# EAGLE design W640D (EAGLE 6.6.0)
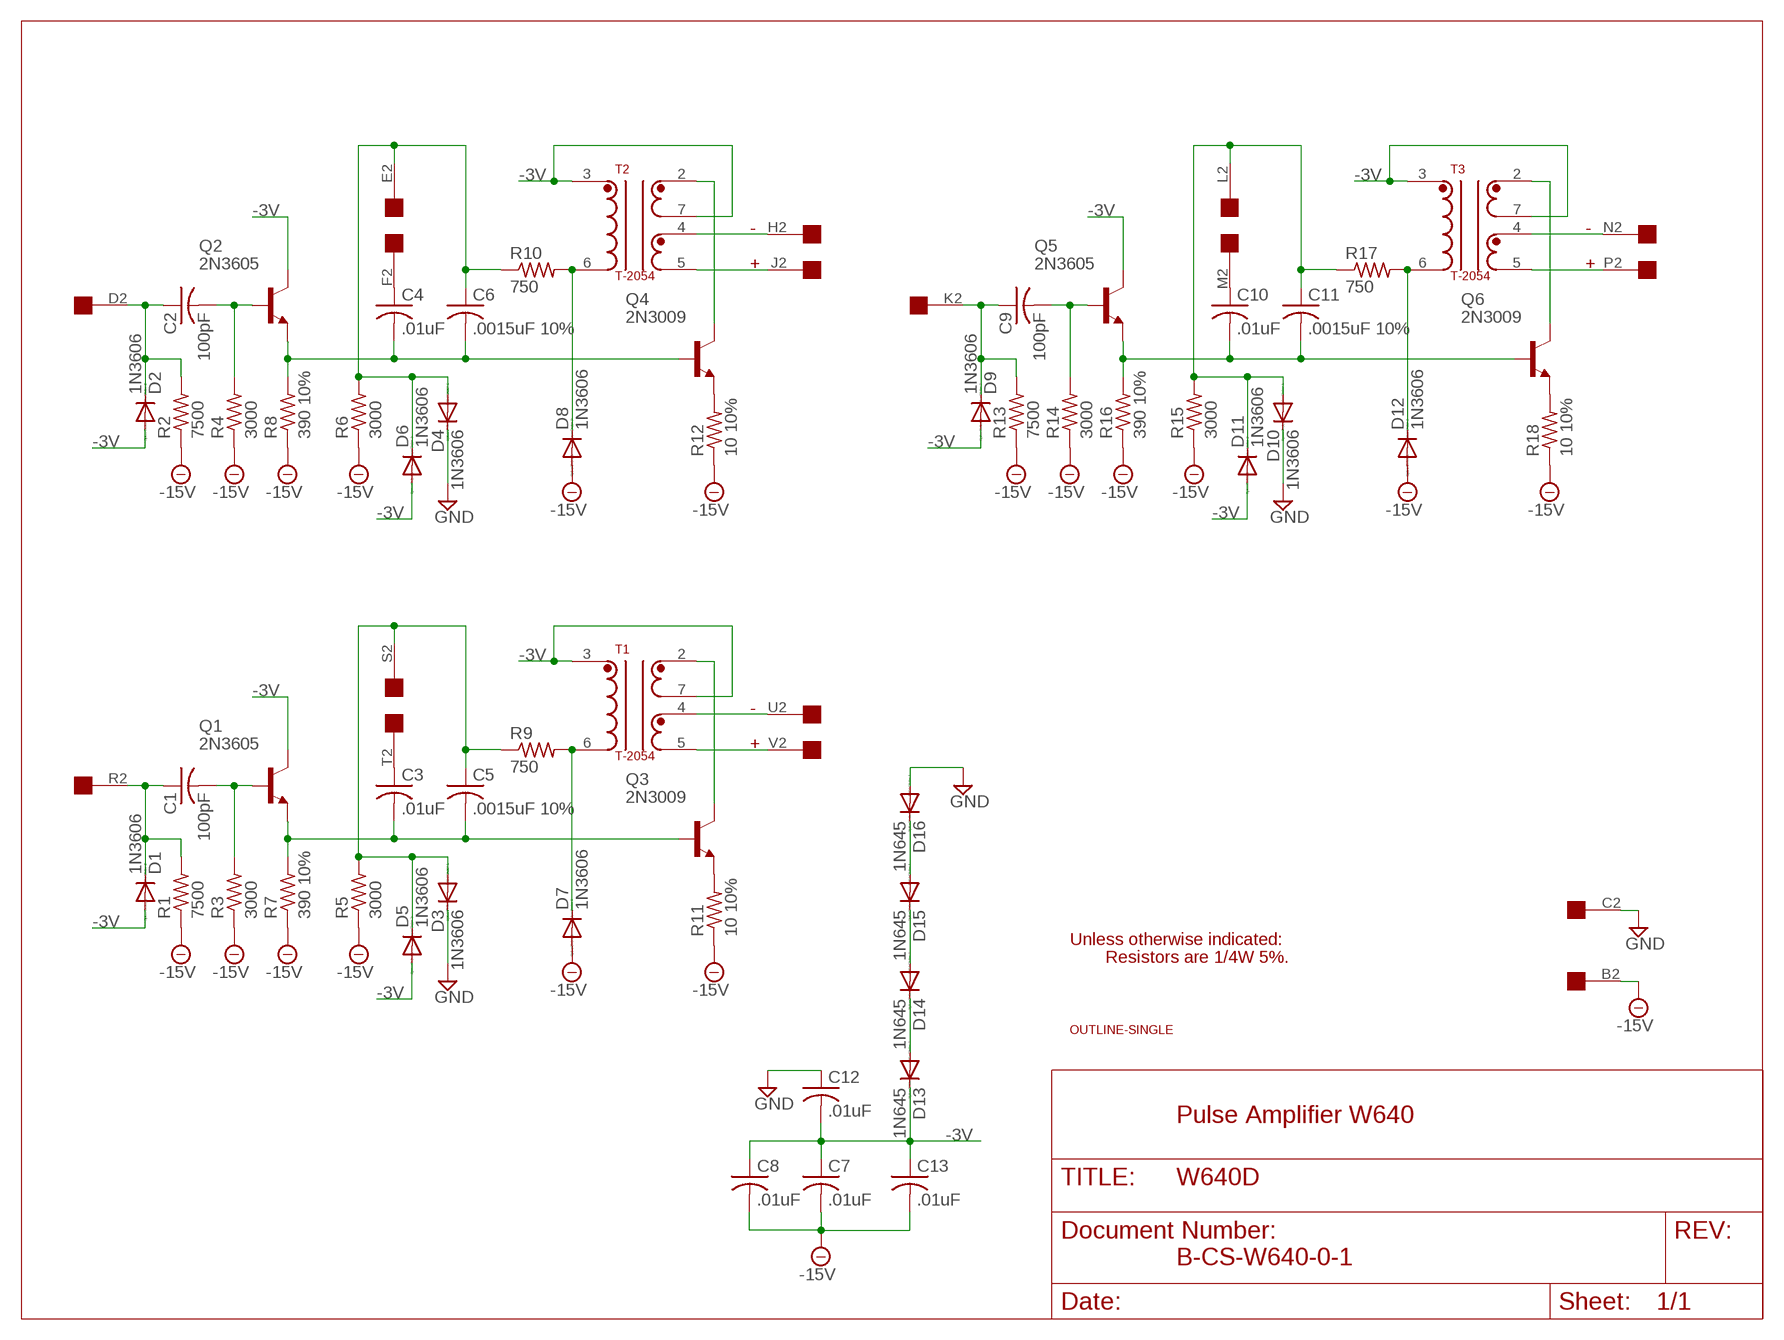
[diagram p0: schematic, sheet 1]

## Parts
C1  100pF  C-US050-025X075  [C050-025X075]
C2  100pF  C-US050-025X075  [C050-025X075]
C3  .01uF  C-US050-025X075  [C050-025X075]
C4  .01uF  C-US050-025X075  [C050-025X075]
C5  .0015uF 10%  C-US050-025X075  [C050-025X075]
C6  .0015uF 10%  C-US050-025X075  [C050-025X075]
C7  .01uF  C-US050-025X075  [C050-025X075]
C8  .01uF  C-US050-025X075  [C050-025X075]
C9  100pF  C-US050-025X075  [C050-025X075]
C10  .01uF  C-US050-025X075  [C050-025X075]
C11  .0015uF 10%  C-US050-025X075  [C050-025X075]
C12  .01uF  C-US050-025X075  [C050-025X075]
C13  .01uF  C-US050-025X075  [C050-025X075]
D1  1N3606  1N4148DO35-10  [DO35-10]
D2  1N3606  1N4148DO35-10  [DO35-10]
D3  1N3606  1N4148DO35-10  [DO35-10]
D4  1N3606  1N4148DO35-10  [DO35-10]
D5  1N3606  1N4148DO35-10  [DO35-10]
D6  1N3606  1N4148DO35-10  [DO35-10]
D7  1N3606  1N4148DO35-10  [DO35-10]
D8  1N3606  1N4148DO35-10  [DO35-10]
D9  1N3606  1N4148DO35-10  [DO35-10]
D10  1N3606  1N4148DO35-10  [DO35-10]
D11  1N3606  1N4148DO35-10  [DO35-10]
D12  1N3606  1N4148DO35-10  [DO35-10]
D13  1N645  1N4148DO35-10  [DO35-10]
D14  1N645  1N4148DO35-10  [DO35-10]
D15  1N645  1N4148DO35-10  [DO35-10]
D16  1N645  1N4148DO35-10  [DO35-10]
Q1  2N3605  2N2219  [TO5]
Q2  2N3605  2N2219  [TO5]
Q3  2N3009  2N2219  [TO5]
Q4  2N3009  2N2219  [TO5]
Q5  2N3605  2N2219  [TO5]
Q6  2N3009  2N2219  [TO5]
R1  7500  R-US_0207/10  [0207/10]
R2  7500  R-US_0207/10  [0207/10]
R3  3000  R-US_0207/10  [0207/10]
R4  3000  R-US_0207/10  [0207/10]
R5  3000  R-US_0207/10  [0207/10]
R6  3000  R-US_0207/10  [0207/10]
R7  390 10%  R-US_0207/10  [0207/10]
R8  390 10%  R-US_0207/10  [0207/10]
R9  750  R-US_0207/10  [0207/10]
R10  750  R-US_0207/10  [0207/10]
R11  10 10%  R-US_0207/10  [0207/10]
R12  10 10%  R-US_0207/10  [0207/10]
R13  7500  R-US_0207/10  [0207/10]
R14  3000  R-US_0207/10  [0207/10]
R15  3000  R-US_0207/10  [0207/10]
R16  390 10%  R-US_0207/10  [0207/10]
R17  750  R-US_0207/10  [0207/10]
R18  10 10%  R-US_0207/10  [0207/10]
T1  T-2054  [TRANSFORMER6B]
T2  T-2054  [TRANSFORMER6B]
T3  T-2054  [TRANSFORMER6B]
U$1  OUTLINE-SINGLE  [SINGLE]
U$2  EDGE-1  [EDGE-CON1]

## Nets
-3V: C7.1 C8.1 C12.2 C13.1 D1.A D2.A D5.A D6.A D9.A D11.A D13.C Q1.3(C) Q2.3(C) Q5.3(C) T1.3 T1.7 T2.3 T2.7 T3.3 T3.7
-15V: C7.2 C8.2 C13.2 D7.A D8.A D12.A R1.1 R2.1 R3.1 R4.1 R5.1 R6.1 R7.1 R8.1 R11.1 R12.1 R13.1 R14.1 R15.1 R16.1 R18.1 U$2.B2
GND [Supply]: C12.1 D3.C D4.C D10.C D16.A U$2.C2
N$1: D8.C R10.2 T2.6
N$2: C2.1 D2.C R2.2 U$2.D2
N$3: C2.2 Q2.2(B) R4.2
N$4: C4.2 C6.2 Q2.1(E) Q4.2(B) R8.2
N$5: C4.1 U$2.F2
N$6: C6.1 D4.A D6.C R6.2 R10.1 U$2.E2
N$7: Q4.3(C) T2.2
N$8: Q4.1(E) R12.2
N$9: T1.4 U$2.U2
N$10: T2.4 U$2.H2
N$11: T1.5 U$2.V2
N$12: T2.5 U$2.J2
N$13: D7.C R9.2 T1.6
N$14: C1.1 D1.C R1.2 U$2.R2
N$15: C1.2 Q1.2(B) R3.2
N$16: C3.2 C5.2 Q1.1(E) Q3.2(B) R7.2
N$17: C3.1 U$2.T2
N$18: C5.1 D3.A D5.C R5.2 R9.1 U$2.S2
N$19: Q3.3(C) T1.2
N$20: Q3.1(E) R11.2
N$21: T3.4 U$2.N2
N$22: T3.5 U$2.P2
N$23: D12.C R17.2 T3.6
N$24: C9.1 D9.C R13.2 U$2.K2
N$25: C9.2 Q5.2(B) R14.2
N$26: C10.2 C11.2 Q5.1(E) Q6.2(B) R16.2
N$27: C10.1 U$2.M2
N$28: C11.1 D10.A D11.C R15.2 R17.1 U$2.L2
N$29: Q6.3(C) T3.2
N$30: Q6.1(E) R18.2
N$31: D15.A D16.C
N$32: D13.A D14.C
N$33: D14.A D15.C
Unconnected: U$2.A2

## Notes on the sheet
- - | -
- + | +
- -
- +
- Unless otherwise indicated:
- Resistors are 1/4W 5%.
- Pulse Amplifier W640
- B-CS-W640-0-1

## Library data of the parts
C1-C13 = rcl:C-US: CAPACITOR, American symbol
D1-D16 = diode:1N4148: DIODE high speed (Philips)
Q1-Q6 = transistor-npn:2N2219: NPN Transistor
R1-R18 = rcl:R-US_: RESISTOR, American symbol
T1-T3 = dec-con:T-2054: T-2054 Pulse Transformer
U$1 = dec-con:OUTLINE-*: Board outlines for DEC boards.
U$2 = dec-con:EDGE-1: Single-Sided DEC Edge Connector -- (side 2)

## Net classes
1 Supply: width 0.813 mm

## Board
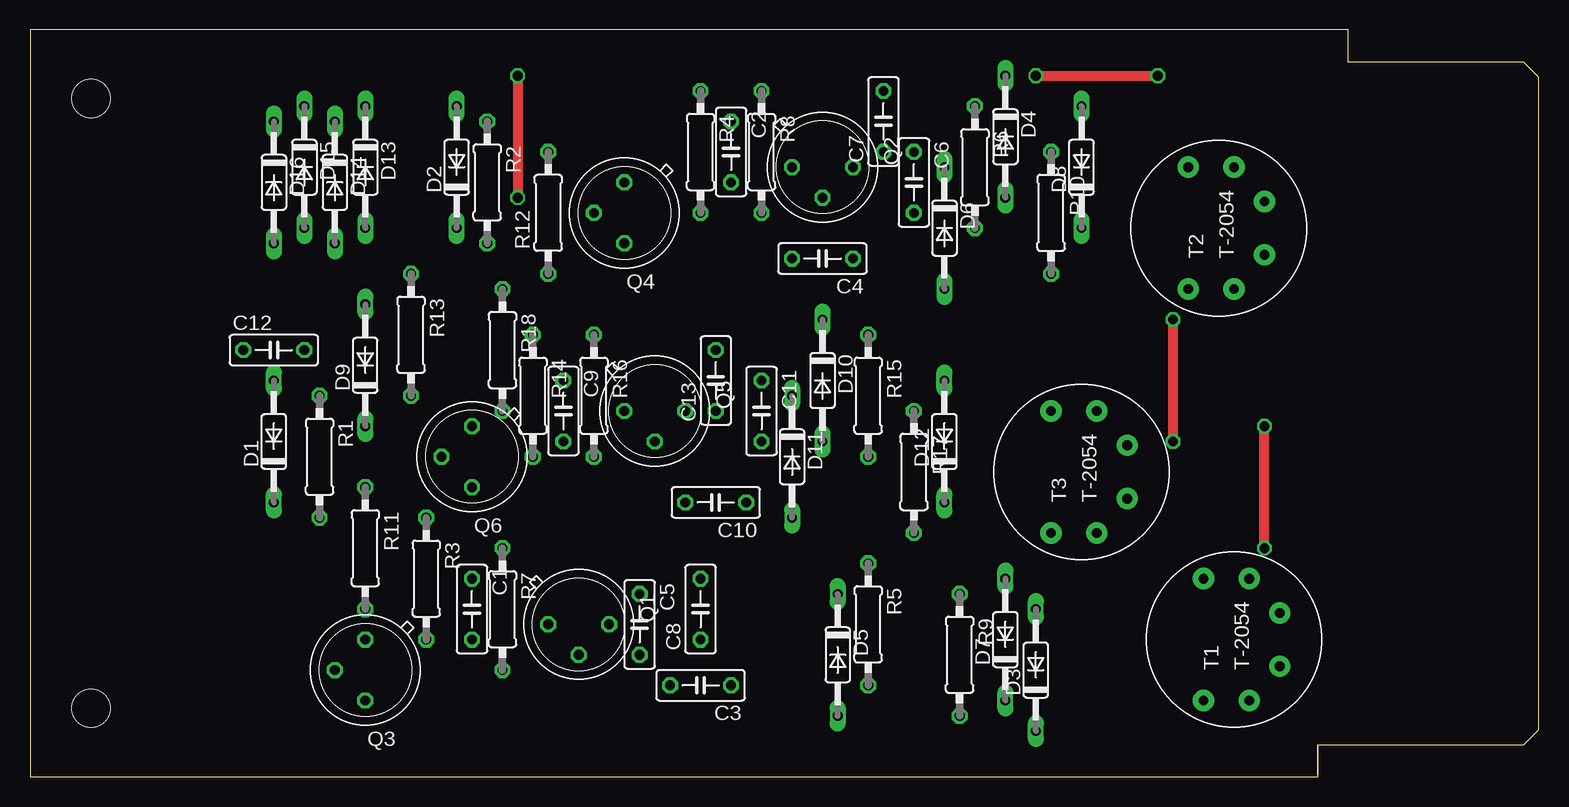
[diagram p1: board, top side]
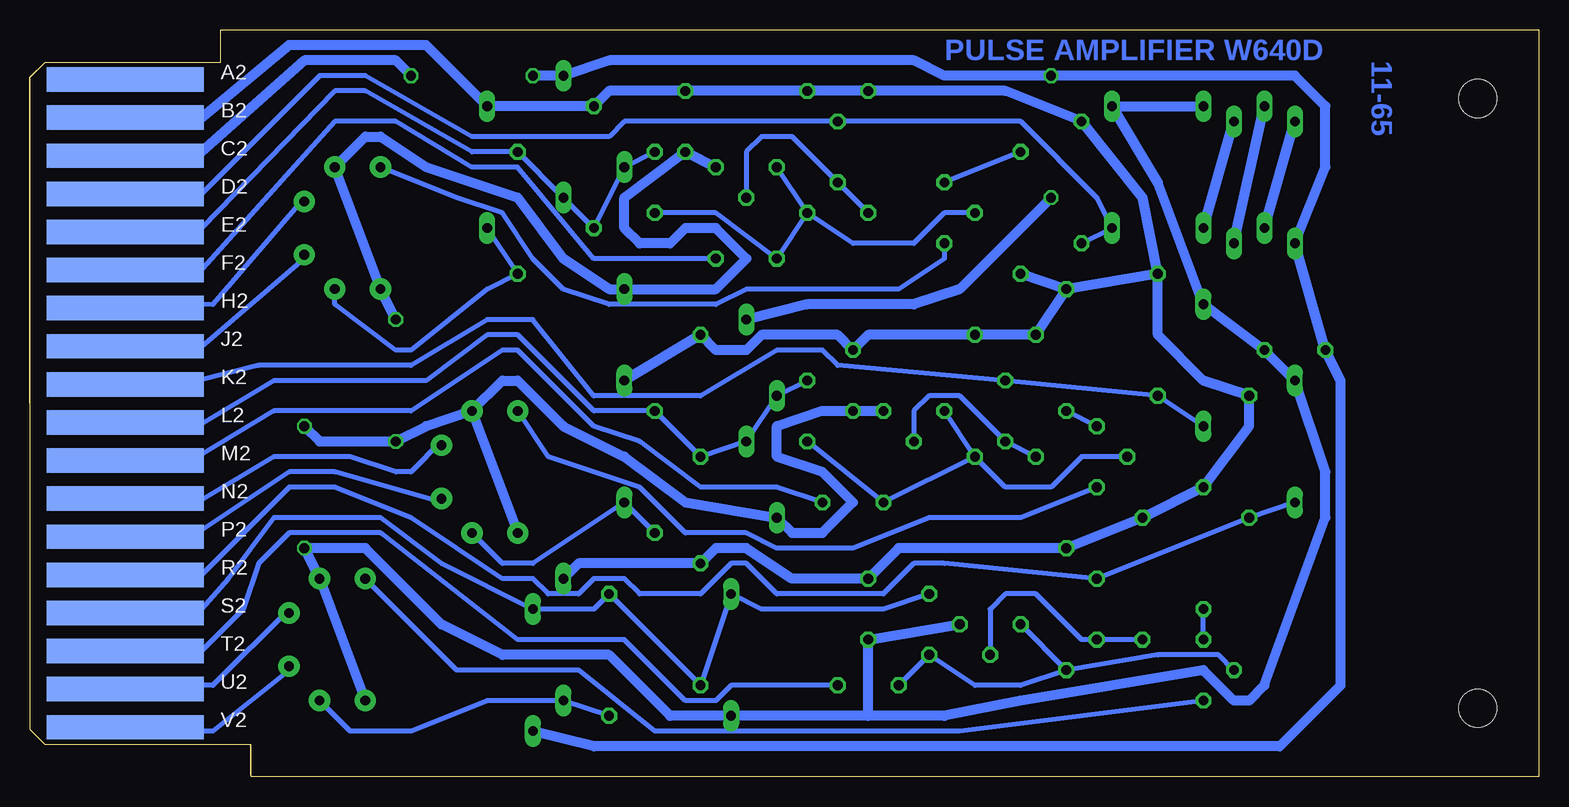
[diagram p2: board, bottom side, seen from below]

Size 125.73 x 62.23 mm. Coordinates in mm from the lower left corner, seen from the top.
Copper layers (1+16): Top 0.035mm / dielectric 1.5mm / Bottom 0.035mm
Design rules "16mils": minimum track width 16mil, minimum drill 32mil, track to track 15mil, track to pad 10mil, pad to pad 10mil, via to via 10mil, smd to smd 10mil, copper to edge 13mil, drill to drill 10mil, minimum pad ring 10mil, minimum via ring 8mil, stop-mask expansion 0mil, vias tented up to drill 0mil, thermal gap 10mil

### Footprints (pad centres in the part's own frame; a part is rotated, then mirrored left to right if it is on the bottom)
C050-025X075 = drill 0.813 octagon: 1 -2.54,0; 2 2.54,0
DO35-10 = drill 0.813 long: A 5.08,0; C -5.08,0
TO5 = drill 0.813 octagon: 1 0,-2.54; 2 2.54,0; 3 0,2.54
0207/10 = drill 0.813 octagon: 1 -5.08,0; 2 5.08,0
TRANSFORMER6B = drill 0.813 pad 1.778: 2 5.08,2.54; 3 5.08,-1.27; 4 2.223,-3.81; 5 -2.223,-3.81; 6 -5.08,-1.27; 7 -5.08,2.54
SINGLE = hole 3.175: 120.65,56.515; 120.65,5.715
EDGE-CON1 = smd 13.106 x 2.032 bottom: A2 7.938,4.128; B2 7.938,7.303; C2 7.938,10.477; D2 7.938,13.652; E2 7.938,16.828; F2 7.938,20.003; H2 7.938,23.177; J2 7.938,26.352; K2 7.938,29.527; L2 7.938,32.703; M2 7.938,35.877; N2 7.938,39.053; P2 7.938,42.227; R2 7.938,45.403; S2 7.938,48.578; T2 7.938,51.752; U2 7.938,54.928; V2 7.938,58.102

### Placement (x,y rotation side)
C1  36.83,13.97 270 top
C2  58.42,52.07 270 top
C3  55.88,7.62 180 top
C4  66.04,43.18 180 top
C5  50.8,12.7 270 top
C6  73.66,49.53 270 top
C7  71.12,54.61 90 top
C8  55.88,13.97 90 top
C9  44.45,30.48 270 top
C10  57.15,22.86 180 top
C11  60.96,30.48 270 top
C12  20.32,35.56 0 top
C13  57.15,33.02 90 top
D1  20.32,27.94 90 top
D2  35.56,50.8 90 top
D3  83.82,8.89 90 top
D4  81.28,53.34 270 top
D5  67.31,10.16 270 top
D6  76.2,45.72 270 top
D7  81.28,11.43 90 top
D8  87.63,50.8 90 top
D9  27.94,34.29 90 top
D10  66.04,33.02 270 top
D11  63.5,26.67 270 top
D12  76.2,27.94 90 top
D13  27.94,50.8 270 top
D14  25.4,49.53 270 top
D15  22.86,50.8 270 top
D16  20.32,49.53 270 top
Q1  45.72,12.7 270 top
Q2  66.04,50.8 270 top
Q3  27.94,8.89 180 top
Q4  49.53,46.99 180 top
Q5  52.07,30.48 270 top
Q6  36.83,26.67 180 top
R1  24.13,26.67 270 top
R2  38.1,49.53 270 top
R3  33.02,16.51 270 top
R4  55.88,52.07 270 top
R5  69.85,12.7 270 top
R6  78.74,50.8 270 top
R7  39.37,13.97 270 top
R8  60.96,52.07 270 top
R9  77.47,10.16 270 top
R10  85.09,46.99 270 top
R11  27.94,19.05 270 top
R12  43.18,46.99 90 top
R13  31.75,36.83 270 top
R14  41.91,31.75 270 top
R15  69.85,31.75 270 top
R16  46.99,31.75 270 top
R17  73.66,25.4 270 top
R18  39.37,35.56 270 top
T1  100.33,11.43 90 top
T2  99.06,45.72 90 top
T3  87.63,25.4 90 top
U$1  125.73,62.23 180 top
U$2  125.73,62.23 180 top

### Tracks (layer width: path | path; a pad name or v marks a point on that pad's centre or on a via)
-3V  (via drill 0.81)
  Top 0.813: v95.25,27.94 v95.25,38.1 | v102.87,19.05 v102.87,29.21
  Bottom 0.813: T3.3 T3.7 | T3.3 92.71,29.21 v95.25,27.94 101.6,27.94 v102.87,29.21 | v95.25,38.1 T2.7 T2.3 97.79,53.34 96.52,53.34 92.71,50.8 85.09,48.26 81.28,43.18 77.47,40.64 D6.A 68.58,40.64 66.04,43.18 68.58,45.72 71.12,45.72 72.39,44.45 74.93,44.45 76.2,45.72 76.2,48.26 C7.1 Q2.3 | T1.7 T1.3 v102.87,19.05 97.79,19.05 91.44,12.7 86.36,10.16 77.47,10.16 72.39,5.08 D5.A 55.88,5.08 | D13.C D2.A 31.75,49.53 D9.A C12.2 D1.A 17.78,25.4 17.78,21.59 22.86,7.62 24.13,6.35 25.4,6.35 27.94,8.89 43.18,6.35 49.53,5.08 55.88,5.08 | T3.3 86.36,33.02 85.09,33.02 81.28,29.21 76.2,26.67 71.12,22.86 D11.A 62.23,20.32 59.69,20.32 57.15,22.86 59.69,25.4 63.5,26.67 63.5,29.21 59.69,30.48 C13.1 Q5.3 | Q1.3 C8.1 55.88,5.08
-15V
  Bottom 0.813: U$2.B2 116.84,54.61 111.76,54.61 104.14,60.96 92.71,60.96 D8.A R6.1 77.47,57.15 C7.2 R8.1 R4.1 44.45,57.15 R2.1 33.02,48.26 R13.1 | R13.1 R18.1 | R18.1 R12.1 | R18.1 R14.1 R16.1 55.88,36.83 C13.2 58.42,36.83 64.77,36.83 66.04,35.56 68.58,35.56 R15.1 D12.A | R13.1 31.75,36.83 27.94,33.02 R1.1 24.13,29.21 R11.1 R3.1 R7.1 53.34,19.05 C8.2 62.23,16.51 66.04,19.05 68.58,19.05 R5.1 80.01,17.78 D7.A
GND  (via drill 0.81)
  Top 0.813: v83.82,58.42 v93.98,58.42 | v40.64,58.42 v40.64,48.26
  Bottom 0.813: U$2.C2 116.84,52.07 111.44,52.07 102.87,59.69 95.25,59.69 v93.98,58.42 | v83.82,58.42 D4.C 77.47,59.69 52.07,59.69 49.53,58.42 v40.64,58.42 20.32,58.42 17.78,55.88 17.78,50.8 D16.A C12.1 16.51,33.02 16.51,7.62 21.59,2.54 78.74,2.54 D3.C | v40.64,48.26 48.26,40.64 52.07,39.37 60.96,39.37 D10.C
N$1
  Bottom 0.406: D8.C R10.2 87.63,40.64 93.98,35.56 95.25,35.56 100.33,39.37 T2.6
N$2
  Bottom 0.406: U$2.D2 116.84,48.26 111.76,48.26 101.6,58.42 97.79,58.42 88.9,53.34 77.47,53.34 76.2,54.61 C2.1 43.18,54.61 36.83,48.26 D2.C R2.2
N$3
  Bottom 0.406: R4.2 C2.2 62.23,53.34 64.77,53.34 66.04,52.07 Q2.2
N$4
  Bottom 0.406: Q4.2 49.53,46.99 52.07,44.45 57.15,44.45 R8.2 | R8.2 Q2.1 | C6.2 68.58,46.99 C4.2 R8.2
N$5
  Bottom 0.406: U$2.F2 116.84,41.91 111.76,41.91 100.33,54.61 95.25,54.61 88.9,50.8 85.09,50.8 78.74,43.18 C4.1
N$6
  Bottom 0.406: C6.1 D6.C R6.2 D4.A R10.1 88.9,52.07 97.79,57.15 100.33,57.15 111.44,45.72 116.84,45.72 U$2.E2
N$7
  Bottom 0.406: T2.2 90.17,48.26 86.36,46.99 83.82,43.18 81.28,40.64 77.47,39.37 68.58,39.37 66.04,40.64 53.34,40.64 49.53,43.18 Q4.3
N$8
  Bottom 0.406: R12.2 Q4.1
N$9
  Bottom 0.406: U$2.U2 117.2,7.26 116.84,7.62 110.49,7.62 104.14,13.97 T1.4
N$10
  Bottom 0.406: U$2.H2 110.49,39.37 102.87,48.26 T2.4
N$11
  Bottom 0.406: U$2.V2 117.16,4.13 116.84,3.81 110.49,3.81 104.14,8.89 T1.5
N$12
  Bottom 0.406: U$2.J2 116.84,35.56 111.76,35.56 102.87,43.18 T2.5
N$13
  Bottom 0.406: R9.2 D7.C 87.63,6.35 93.98,3.81 99.06,3.81 T1.6
N$14
  Bottom 0.406: D1.C R1.2 C1.1 49.53,17.78 52.07,17.78 54.61,15.24 63.5,15.24 66.04,17.78 67.31,17.78 69.85,15.24 74.93,15.24 76.2,16.51 78.74,16.51 80.01,15.24 82.55,15.24 83.82,16.51 86.36,16.51 93.98,21.59 100.33,24.13 104.14,24.13 111.76,16.51 116.84,16.51 U$2.R2
N$15
  Bottom 0.406: R3.2 C1.2 38.1,11.43 41.91,15.24 44.45,15.24 45.72,13.97 Q1.2
N$16
  Bottom 0.406: Q3.2 26.67,10.16 31.75,10.16 R7.2 | R7.2 Q1.1 | R7.2 43.18,7.62 46.99,7.62 C5.2 C3.2
N$17
  Bottom 0.406: C3.1 67.31,7.62 68.58,6.35 71.12,6.35 76.2,11.43 85.09,11.43 96.52,20.32 104.14,20.32 106.68,17.78 107.95,13.97 111.76,10.16 116.84,10.16 U$2.T2
N$18
  Bottom 0.406: C5.1 54.61,13.97 64.77,13.97 D5.C R5.2 R9.1 78.74,13.97 D3.A 91.44,17.78 96.52,21.59 105.41,21.59 109.22,16.51 111.44,13.97 116.84,13.97 U$2.S2
N$19
  Bottom 0.406: Q3.3 48.26,3.81 73.66,3.81 80.01,8.89 90.17,8.89 T1.2
N$20
  Bottom 0.406: Q3.1 R11.2
N$21
  Bottom 0.406: U$2.N2 116.84,22.86 111.76,22.86 105.41,26.67 99.06,26.67 95.25,25.4 93.98,25.4 91.44,27.94 T3.4
N$22
  Bottom 0.406: U$2.P2 117.17,19.99 116.84,20.32 111.76,20.32 104.14,25.4 100.33,25.4 91.44,22.86 T3.5
N$23
  Bottom 0.406: T3.6 86.36,17.78 83.82,17.78 D12.C R17.2
N$24
  Bottom 0.406: U$2.K2 116.84,33.02 111.76,33.02 106.68,34.29 93.98,34.29 87.63,38.1 83.82,38.1 78.74,31.75 69.85,31.75 63.5,35.56 59.69,35.56 58.42,34.29 C9.1 R13.2 D9.C
N$25
  Bottom 0.406: Q5.2 52.07,30.48 50.8,31.75 48.26,31.75 C9.2 R14.2
N$26
  Bottom 0.406: C11.2 C10.2 R16.2 | Q6.2 38.1,26.67 40.64,24.13 44.45,24.13 R16.2 | R16.2 Q5.1
N$27
  Bottom 0.406: U$2.M2 116.84,26.67 111.76,26.67 105.41,30.48 93.98,30.48 86.36,35.56 85.09,35.56 78.74,29.21 74.93,27.94 69.85,24.13 63.5,24.13 C10.1
N$28
  Bottom 0.406: U$2.L2 116.84,29.21 111.76,29.21 105.41,33.02 92.71,33.02 87.63,36.83 85.09,36.83 78.74,30.48 R17.1 R15.2 D10.A D11.C C11.1
N$29
  Bottom 0.406: T3.2 82.55,26.67 74.93,24.13 71.12,20.32 66.04,20.32 63.5,19.05 57.15,19.05 50.8,21.59 43.18,21.59 Q6.3
N$30
  Bottom 0.406: Q6.1 R18.2
N$31
  Bottom 0.813: D15.A D16.C
N$32
  Bottom 0.813: D13.A D14.C
N$33
  Bottom 0.813: D14.A D15.C

### Text on the board
Bottom: 11-65 | PULSE AMPLIFIER W640D